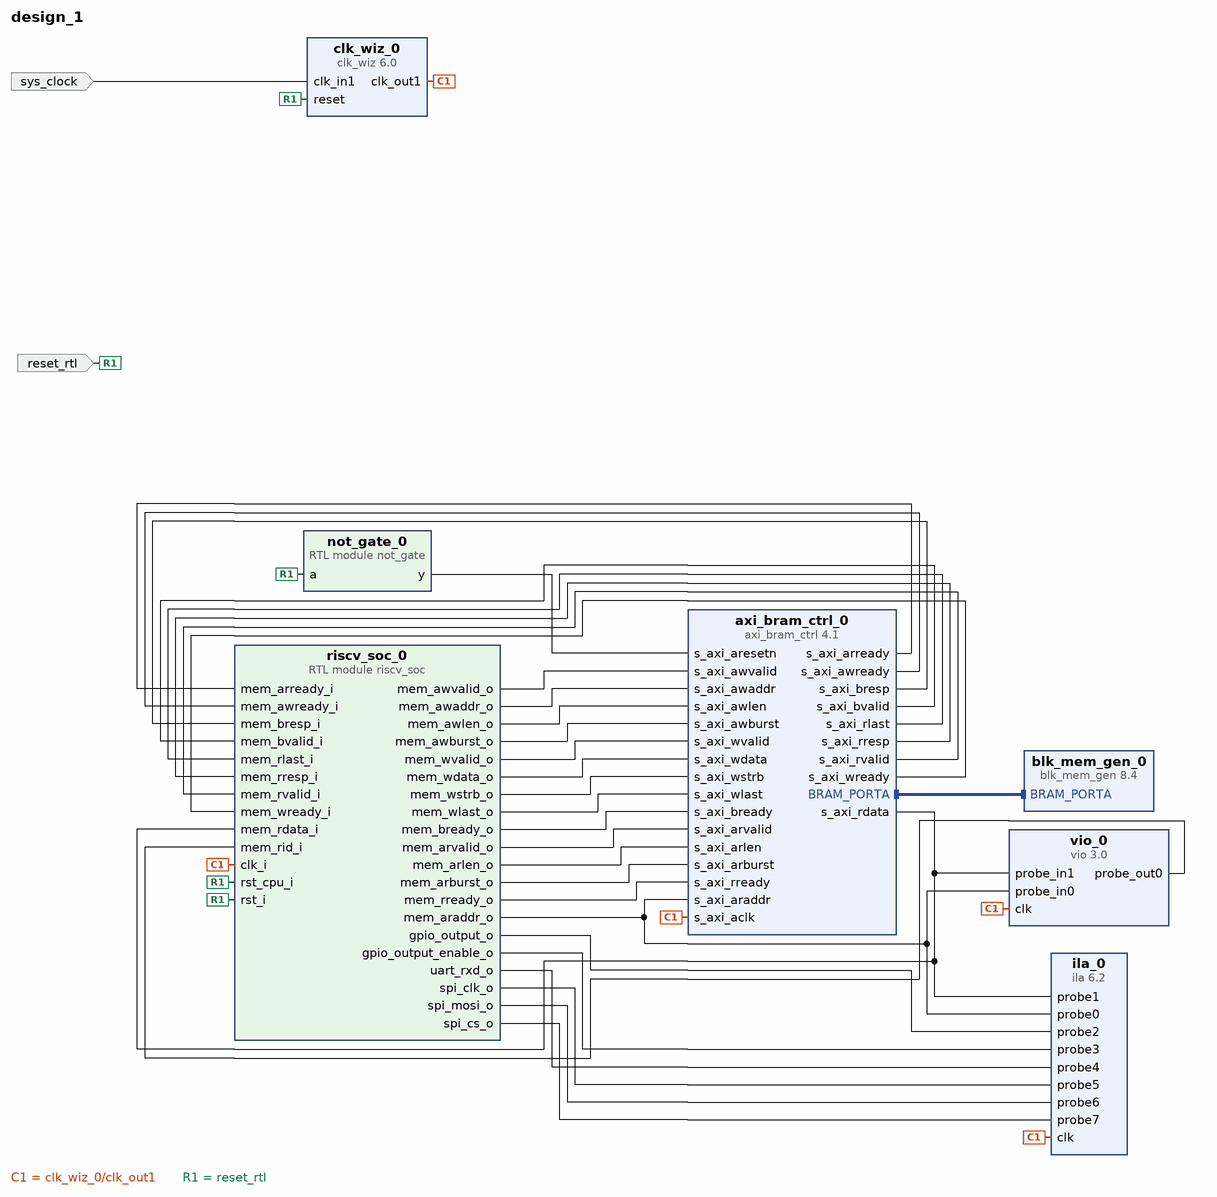
[diagram p0: block diagram of the top level]
# Vivado block design design_1, xc7z020clg400-1, Vivado 2020.2
create_bd_design design_1

create_bd_port -dir I -type clk sys_clock
set_property -dict {CONFIG.FREQ_HZ 125000000 CONFIG.PHASE 0.000} [get_bd_ports sys_clock]
create_bd_port -dir I -type rst reset_rtl
set_property -dict {CONFIG.POLARITY ACTIVE_HIGH} [get_bd_ports reset_rtl]

create_bd_cell -type ip -vlnv xilinx.com:ip:axi_bram_ctrl:4.1 axi_bram_ctrl_0
set_property -dict {CONFIG.SINGLE_PORT_BRAM 1} [get_bd_cells axi_bram_ctrl_0]
create_bd_cell -type ip -vlnv xilinx.com:ip:blk_mem_gen:8.4 blk_mem_gen_0
set_property -dict [list \
  CONFIG.Coe_File soc_coe_new.coe \
  CONFIG.EN_SAFETY_CKT true \
  CONFIG.Enable_32bit_Address true \
  CONFIG.Fill_Remaining_Memory_Locations true \
  CONFIG.Load_Init_File true \
  CONFIG.Register_PortA_Output_of_Memory_Primitives true \
  CONFIG.Use_RSTA_Pin true \
  CONFIG.Write_Depth_A 100000 \
  CONFIG.use_bram_block Stand_Alone \
] [get_bd_cells blk_mem_gen_0]
create_bd_cell -type ip -vlnv xilinx.com:ip:ila:6.2 ila_0
set_property -dict [list \
  CONFIG.C_ENABLE_ILA_AXI_MON false \
  CONFIG.C_MONITOR_TYPE Native \
  CONFIG.C_NUM_OF_PROBES 8 \
  CONFIG.C_PROBE0_WIDTH 32 \
  CONFIG.C_PROBE1_WIDTH 32 \
  CONFIG.C_PROBE2_WIDTH 32 \
  CONFIG.C_PROBE3_WIDTH 32 \
] [get_bd_cells ila_0]
create_bd_cell -type ip -vlnv xilinx.com:ip:vio:3.0 vio_0
set_property -dict {CONFIG.C_NUM_PROBE_IN 2 CONFIG.C_PROBE_OUT0_WIDTH 4} [get_bd_cells vio_0]
create_bd_cell -type module -reference not_gate not_gate_0
create_bd_cell -type ip -vlnv xilinx.com:ip:clk_wiz:6.0 clk_wiz_0
set_property -dict {CONFIG.CLK_IN1_BOARD_INTERFACE sys_clock CONFIG.USE_BOARD_FLOW true} [get_bd_cells clk_wiz_0]
create_bd_cell -type module -reference riscv_soc riscv_soc_0

# ---- connections ----

connect_bd_intf_net [get_bd_intf_pins axi_bram_ctrl_0/BRAM_PORTA] [get_bd_intf_pins blk_mem_gen_0/BRAM_PORTA]
connect_bd_net [get_bd_pins riscv_soc_0/mem_awvalid_o] [get_bd_pins axi_bram_ctrl_0/s_axi_awvalid]
connect_bd_net [get_bd_pins riscv_soc_0/mem_awaddr_o] [get_bd_pins axi_bram_ctrl_0/s_axi_awaddr]
connect_bd_net [get_bd_pins riscv_soc_0/mem_awlen_o] [get_bd_pins axi_bram_ctrl_0/s_axi_awlen]
connect_bd_net [get_bd_pins riscv_soc_0/mem_awburst_o] [get_bd_pins axi_bram_ctrl_0/s_axi_awburst]
connect_bd_net [get_bd_pins riscv_soc_0/mem_wvalid_o] [get_bd_pins axi_bram_ctrl_0/s_axi_wvalid]
connect_bd_net [get_bd_pins riscv_soc_0/mem_wdata_o] [get_bd_pins axi_bram_ctrl_0/s_axi_wdata]
connect_bd_net [get_bd_pins riscv_soc_0/mem_wstrb_o] [get_bd_pins axi_bram_ctrl_0/s_axi_wstrb]
connect_bd_net [get_bd_pins riscv_soc_0/mem_wlast_o] [get_bd_pins axi_bram_ctrl_0/s_axi_wlast]
connect_bd_net [get_bd_pins riscv_soc_0/mem_bready_o] [get_bd_pins axi_bram_ctrl_0/s_axi_bready]
connect_bd_net [get_bd_pins riscv_soc_0/mem_arvalid_o] [get_bd_pins axi_bram_ctrl_0/s_axi_arvalid]
connect_bd_net [get_bd_pins riscv_soc_0/mem_araddr_o] \
  [get_bd_pins axi_bram_ctrl_0/s_axi_araddr] [get_bd_pins ila_0/probe0] [get_bd_pins vio_0/probe_in0]
connect_bd_net [get_bd_pins riscv_soc_0/mem_arlen_o] [get_bd_pins axi_bram_ctrl_0/s_axi_arlen]
connect_bd_net [get_bd_pins riscv_soc_0/mem_arburst_o] [get_bd_pins axi_bram_ctrl_0/s_axi_arburst]
connect_bd_net [get_bd_pins riscv_soc_0/mem_rready_o] [get_bd_pins axi_bram_ctrl_0/s_axi_rready]
connect_bd_net [get_bd_pins axi_bram_ctrl_0/s_axi_arready] [get_bd_pins riscv_soc_0/mem_arready_i]
connect_bd_net [get_bd_pins axi_bram_ctrl_0/s_axi_awready] [get_bd_pins riscv_soc_0/mem_awready_i]
connect_bd_net [get_bd_pins axi_bram_ctrl_0/s_axi_bresp] [get_bd_pins riscv_soc_0/mem_bresp_i]
connect_bd_net [get_bd_pins axi_bram_ctrl_0/s_axi_bvalid] [get_bd_pins riscv_soc_0/mem_bvalid_i]
connect_bd_net [get_bd_pins axi_bram_ctrl_0/s_axi_rdata] \
  [get_bd_pins ila_0/probe1] [get_bd_pins vio_0/probe_in1] [get_bd_pins riscv_soc_0/mem_rdata_i]
connect_bd_net [get_bd_pins axi_bram_ctrl_0/s_axi_rlast] [get_bd_pins riscv_soc_0/mem_rlast_i]
connect_bd_net [get_bd_pins axi_bram_ctrl_0/s_axi_rresp] [get_bd_pins riscv_soc_0/mem_rresp_i]
connect_bd_net [get_bd_pins axi_bram_ctrl_0/s_axi_rvalid] [get_bd_pins riscv_soc_0/mem_rvalid_i]
connect_bd_net [get_bd_pins axi_bram_ctrl_0/s_axi_wready] [get_bd_pins riscv_soc_0/mem_wready_i]
connect_bd_net [get_bd_pins riscv_soc_0/gpio_output_o] [get_bd_pins ila_0/probe2]
connect_bd_net [get_bd_pins riscv_soc_0/gpio_output_enable_o] [get_bd_pins ila_0/probe3]
connect_bd_net [get_bd_pins riscv_soc_0/uart_rxd_o] [get_bd_pins ila_0/probe4]
connect_bd_net [get_bd_pins riscv_soc_0/spi_clk_o] [get_bd_pins ila_0/probe5]
connect_bd_net [get_bd_pins riscv_soc_0/spi_mosi_o] [get_bd_pins ila_0/probe6]
connect_bd_net [get_bd_pins riscv_soc_0/spi_cs_o] [get_bd_pins ila_0/probe7]
connect_bd_net [get_bd_pins vio_0/probe_out0] [get_bd_pins riscv_soc_0/mem_rid_i]
connect_bd_net [get_bd_pins clk_wiz_0/clk_out1] \
  [get_bd_pins vio_0/clk] [get_bd_pins axi_bram_ctrl_0/s_axi_aclk] [get_bd_pins ila_0/clk] [get_bd_pins riscv_soc_0/clk_i]
connect_bd_net [get_bd_pins not_gate_0/y] [get_bd_pins axi_bram_ctrl_0/s_axi_aresetn]
connect_bd_net [get_bd_ports sys_clock] [get_bd_pins clk_wiz_0/clk_in1]
connect_bd_net [get_bd_ports reset_rtl] \
  [get_bd_pins clk_wiz_0/reset] [get_bd_pins not_gate_0/a] [get_bd_pins riscv_soc_0/rst_i] \
  [get_bd_pins riscv_soc_0/rst_cpu_i]

validate_bd_design
save_bd_design
